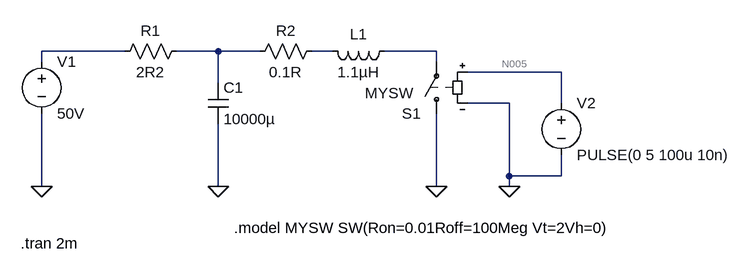
[diagram p0: schematic OVP max current simulation.asc]
OVP max current simulation.asc, the LTspice schematic file:
Version 4
SHEET 1 1008 680
WIRE 64 64 -64 64
WIRE 208 64 144 64
WIRE 272 64 208 64
WIRE 384 64 352 64
WIRE 544 64 464 64
WIRE -64 80 -64 64
WIRE 544 80 544 64
WIRE 736 96 592 96
WIRE 208 112 208 64
WIRE 656 144 592 144
WIRE 736 144 736 96
WIRE 656 256 656 144
WIRE 736 256 736 224
WIRE 736 256 656 256
WIRE -64 272 -64 160
WIRE 208 272 208 176
WIRE 544 272 544 160
WIRE 656 272 656 256
FLAG -64 272 0
FLAG 208 272 0
FLAG 544 272 0
FLAG 656 272 0
SYMBOL voltage -64 64 R0
WINDOW 123 0 0 Left 2
WINDOW 39 0 0 Left 2
SYMATTR InstName V1
SYMATTR Value 50V
SYMBOL res 160 48 R90
WINDOW 0 0 56 VBottom 2
WINDOW 3 32 56 VTop 2
SYMATTR InstName R1
SYMATTR Value 2R2
SYMBOL cap 192 112 R0
SYMATTR InstName C1
SYMATTR Value 10000µ
SYMBOL res 368 48 R90
WINDOW 0 0 56 VBottom 2
WINDOW 3 32 56 VTop 2
SYMATTR InstName R2
SYMATTR Value 0.1R
SYMBOL ind 480 48 R90
WINDOW 0 5 56 VBottom 2
WINDOW 3 32 56 VTop 2
SYMATTR InstName L1
SYMATTR Value 1.1µH
SYMBOL sw 544 176 R180
WINDOW 3 36 48 Left 2
SYMATTR Value MYSW
SYMATTR InstName S1
SYMBOL voltage 736 128 R0
WINDOW 123 0 0 Left 2
WINDOW 39 0 0 Left 2
SYMATTR InstName V2
SYMATTR Value PULSE(0 5 100u 10n)
TEXT 232 336 Left 2 !.model MYSW SW(Ron=0.01Roff=100Meg Vt=2Vh=0)
TEXT -96 360 Left 2 !.tran 2m

The netlist it stands for:
* OVP max current simulation.asc
V1 N001 0 50V
R1 N002 N001 2R2
C1 N002 0 10000µ
R2 N003 N002 0.1R
L1 N004 N003 1.1µH
S1 0 N004 N005 0 MYSW
V2 N005 0 PULSE(0 5 100u 10n)
.model MYSW SW(Ron=0.01Roff=100Meg Vt=2Vh=0)
.tran 2m
.backanno
.end

* Results of the author's LTspice run, read from the files saved beside the schematic
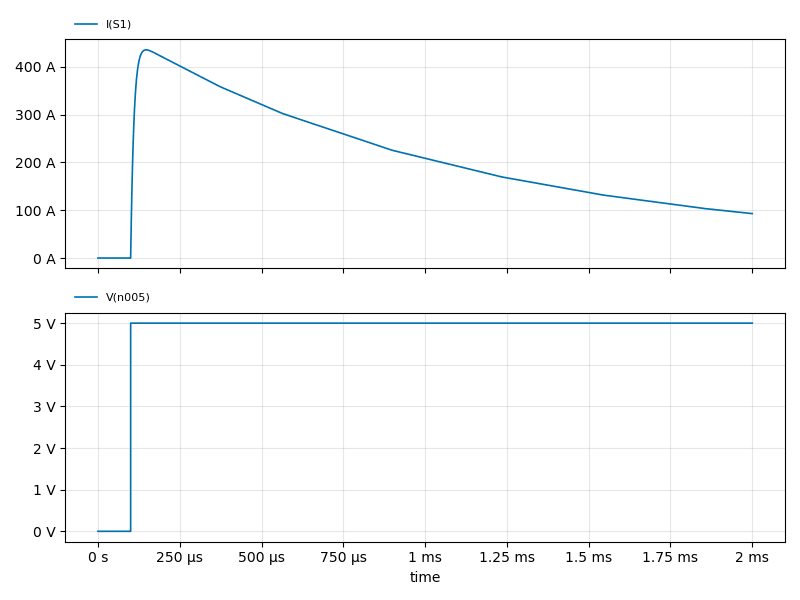
[diagram p1: Transient Analysis of OVP max current simulation.asc, plotted from the saved traces]
* Transient Analysis, 1 run:
*   I(S1): min 0 A, max 435.4 A, average 210.8 A, rms 238.2 A, last 92.85 A
*   V(n005): min 0 V, max 5 V, average 4.75 V, rms 4.873 V, last 5 V